# EAGLE design OBD-II (EAGLE 7.6.0)
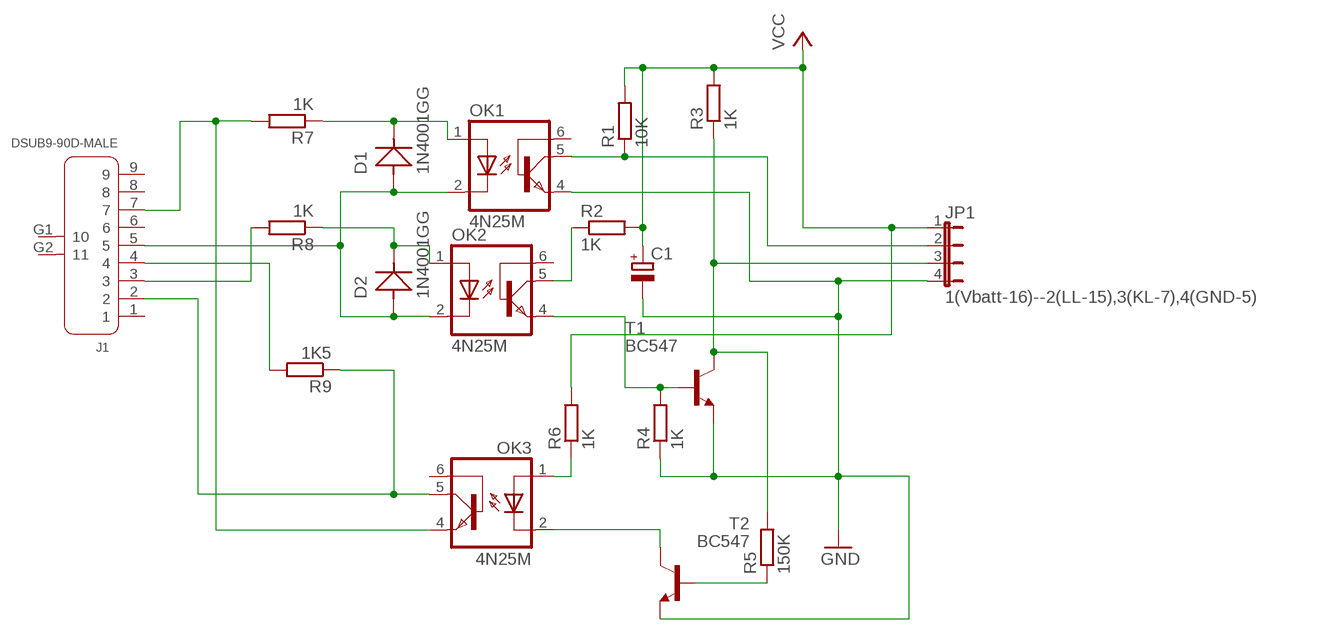
[diagram p0: schematic, sheet 1]

## Parts
C1  CPOL-EUE2-5  [E2-5]
D1  1N4001GG  [DO-41]
D2  1N4001GG  [DO-41]
J1  DSUB9-90D-MALE  DIP-MALE-DB9-CONNECTOR  [DSUB9+2P-2.77-90D-MALE]
JP1  1(Vbatt-16)--2(LL-15),3(KL-7),4(GND-5)  JP4E  [JP4]
OK1  4N25M  [DIL06]
OK2  4N25M  [DIL06]
OK3  4N25M  [DIL06]
R1  10K  R-EU_0207/10  [0207/10]
R2  1K  R-EU_0207/10  [0207/10]
R3  1K  R-EU_0207/10  [0207/10]
R4  1K  R-EU_0207/10  [0207/10]
R5  150K  R-EU_0207/10  [0207/10]
R6  1K  R-EU_0207/10  [0207/10]
R7  1K  R-EU_0207/10  [0207/10]
R8  1K  R-EU_0207/10  [0207/10]
R9  1K5  R-EU_0207/10  [0207/10]
T1  BC547  [TO92]
T2  BC547  [TO92]

## Nets
GND: C1.- JP1.4 OK1.4(EMI) R4.1 T1.1(E) T2.1(E)
N$1: JP1.2 OK1.5(COL) R1.1
N$2: J1.2 OK3.5(COL) R9.1
N$3: J1.4 R9.2
N$4: J1.3 R8.2
N$5: OK2.5(COL) R2.1
N$6: JP1.3 R3.1 R5.2 T1.3(C)
N$7: OK2.4(EMI) R4.2 T1.2(B)
N$8: J1.7 OK3.4(EMI) R7.2
N$10: R5.1 T2.2(B)
N$11: OK3.1(A) R6.1
N$12: D1.A D2.A J1.5 OK1.2(C) OK2.2(C)
N$13: OK3.2(C) T2.3(C)
N$16: D2.C OK2.1(A) R8.1
N$17: D1.C OK1.1(A) R7.1
VCC: C1.+ JP1.1 R1.2 R2.2 R3.2 R6.2
Unconnected: J1.1 J1.6 J1.8 J1.9 J1.G1 J1.G2 OK1.6(BAS) OK2.6(BAS) OK3.6(BAS)

## Library data of the parts
C1 = rcl:CPOL-EU: POLARIZED CAPACITOR, European symbol
D1 D2 = Volks73-ONSemiconductor:1N*?: Diode Axial Lead Standard Recovery Rectifiers Documentation Datasheet <http://www.onsemi.com/pub_link/Collateral/1N4001-D.PDF> Features Shipped in Plastic Bags, 1000 per bag Available Tape and Reeled, 5000 per reel, by adding a “RL” suffix to the part number Available in Fan−Fold Packaging, 3000 per box, by adding a “FF” suffix to the part number Pb−Free Packages are Available Mechanical Characteristics Case: Epoxy, Molded Weight: 0.4 gram (approximately) Finish: All External Surfaces Corrosion Resistant and Terminal Leads are Readily Solderable Lead and Mounting Surface Temperature for Soldering Purposes: 260°C Max. for 10 Seconds, 1/16 in. from case Polarity: Cathode Indicated by Polarity Band; CAPACITANCE: -; CATEGORY: Discrete Semiconductor Products; CURRENT-AVERAGE_RECTIFIED: 1A; CURRENT-REVERSE_LEAKAGE: 10uA @ 50V; DESCRIPTION: DIODE GEN PURP 50V 1A DO41; DIODE_TYPE: Standard; DOCUMENTATION_LINK: <a href="http://www.onsemi.com/pub_link/Collateral/1N4001-D.PDF">Datasheet</a>; DOCUMENTATION_URL: http://www.onsemi.com/pub_link/Collateral/1N4001-D.PDF; FAMILY: Diodes, Rectifiers, - Single; MANUFACTURER: ON Semiconductor; MOUNTING_TYPE: Through Hole; OPERATING_TEMPERATURE-JUNCTION: -64C ~ 175C; PACKAGE: DO-204AL, DO-41, Axial; PART_NUMBER: 1N4001G; REVERSE_RECOVERY-TIME: -; SERIES: -; SPEED: Standard Recovery >500ns, > 200mA (Io); SUPPLIER_DEVICE_PACKAGE: DO-41; SUPPLIER_ITEM_LINK: <a href="http://www.digikey.com/product-detail/en/1N4001G/1N4001GOS-ND/1485468">Details</a>; SUPPLIER_ITEM_NUMBER: 1N4001GOS-ND; SUPPLIER_ITEM_URL: http://www.digikey.com/product-detail/en/1N4001G/1N4001GOS-ND/1485468; SUPPLIER_LINK: <a href="http://www.digikey.com">Home Page</a>; SUPPLIER_NAME: Digi-Key; SUPPLIER_URL: http://www.digikey.com; VOLTAGE-DC_REVERSE: 50V; VOLTAGE-FORWARD: 1.1V @ 1A
J1 = Seeed-OPL-Connector:DIP-MALE-DB9-CONNECTOR: 320110017
JP1 = jumper:JP4E: JUMPER
OK1-OK3 = optocoupler:4N*?M: General Purpose 6-Pin Phototransistor Optocouplers Source: http://www.fairchildsemi.com/ds/4N/4N35-M.pdf; MPN: 4N25-M; OC_FARNELL: 1021349; OC_NEWARK: 98K9084
R1-R9 = rcl:R-EU_: RESISTOR, European symbol
T1 T2 = transistor:BC547: NPN TRANSISTOR

## Board
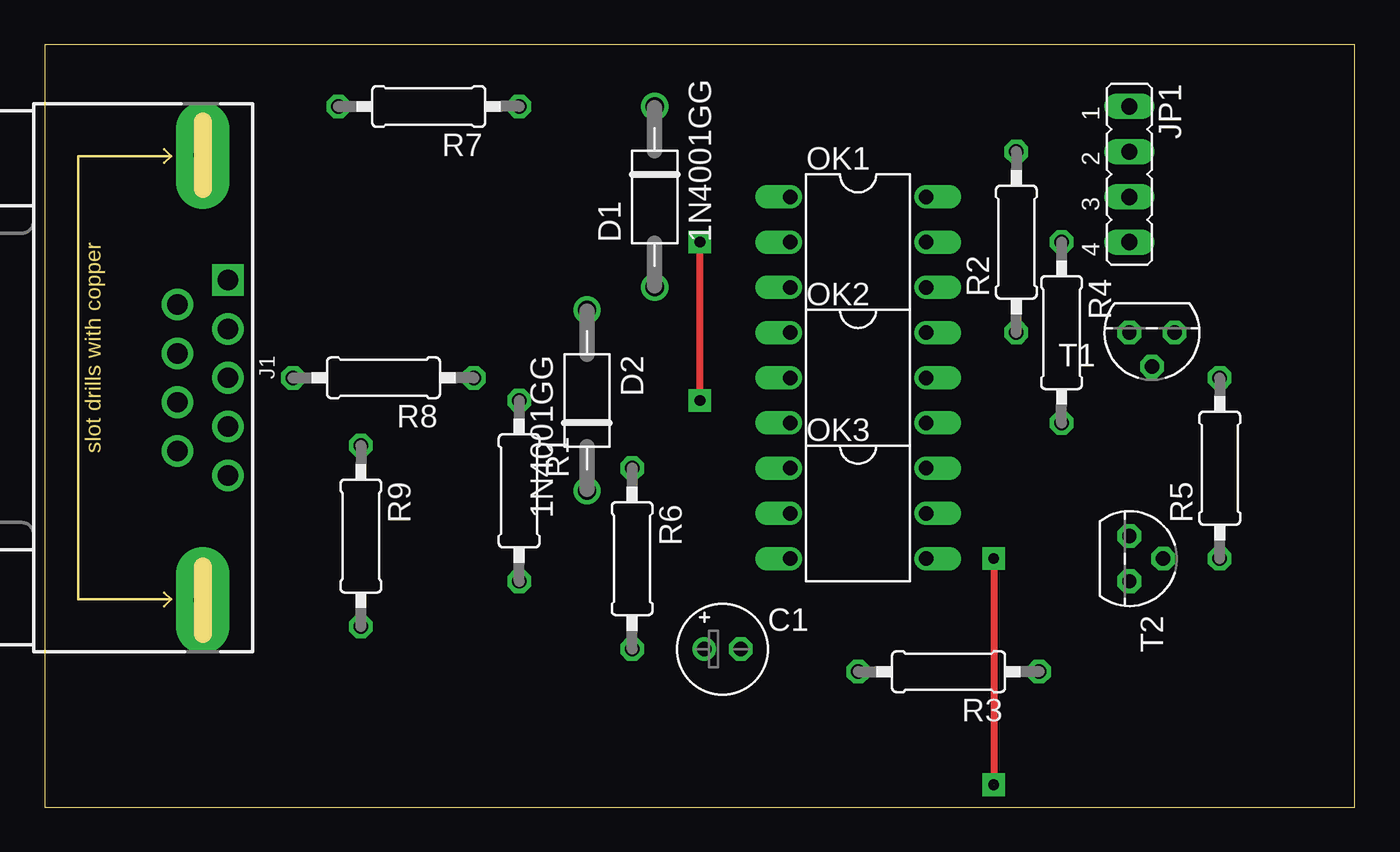
[diagram p1: board, top side]
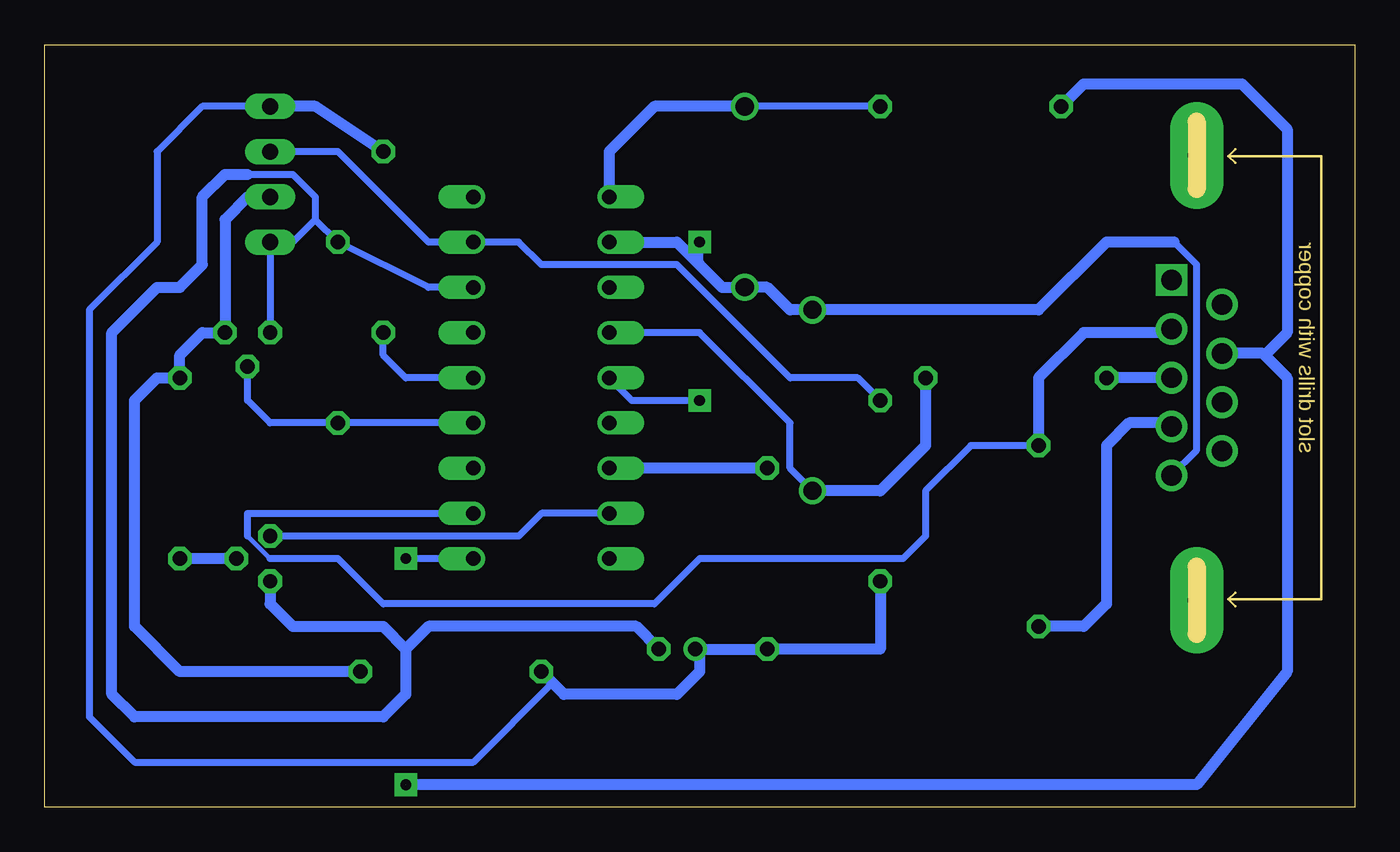
[diagram p2: board, bottom side, seen from below]

Size 73.64 x 42.85 mm. Coordinates in mm from the lower left corner, seen from the top.
Outline: 0,0 73.64,0 73.64,42.85 0,42.85 0,0
Copper layers (1*16): Top 0.035mm / dielectric 1.5mm / Bottom 0.035mm
Design rules "default": minimum track width 10mil, minimum drill 24mil, track to track 8mil, track to pad 8mil, pad to pad 8mil, via to via 8mil, smd to smd 8mil, copper to edge 40mil, drill to drill 8mil, minimum pad ring 10mil, minimum via ring 8mil, stop-mask expansion 4mil, vias tented up to drill 0mil, thermal gap 10mil

### Footprints (pad centres in the part's own frame; a part is rotated, then mirrored left to right if it is on the bottom)
E2-5 = drill 0.813 pad 1.27: + -1.016,0 | drill 0.813 pad 1.27 octagon: - 1.016,0
DO-41 = drill 1.016: A 0,-5.08; C 0,5.08
DSUB9+2P-2.77-90D-MALE = drill 1.143 pad 1.778 square: 1 -5.486,1.422 | drill 1.143 pad 1.778: 2 -2.743,1.422; 3 0,1.422; 4 2.743,1.422; 5 5.486,1.422; 6 -4.115,-1.422; 7 -1.372,-1.422; 8 1.372,-1.422; 9 4.115,-1.422 | drill 1 pad 3 long: G1 12.497,0; G2 -12.497,0
JP4 = drill 0.914 long: 1 -3.81,0; 2 -1.27,0; 3 1.27,0; 4 3.81,0
DIL06 = drill 0.813 offset: 1 -2.54,-3.81; 2 0,-3.81; 3 2.54,-3.81; 4 2.54,3.81; 5 0,3.81; 6 -2.54,3.81
0207/10 = drill 0.813 octagon: 1 -5.08,0; 2 5.08,0
TO92 = drill 0.813 octagon: 1 1.27,0; 2 0,1.905; 3 -1.27,0

### Placement (x,y rotation side)
C1  38.1,8.89 0 top
D1  34.29,34.29 0 top
D2  30.48,22.86 180 top
J1  8.89,24.13 270 top
JP1  60.96,35.56 270 top
OK1  45.72,31.75 270 top
OK2  45.72,24.13 270 top
OK3  45.72,16.51 270 top
R1  26.67,17.78 270 top
R2  54.61,31.75 90 top
R3  50.8,7.62 180 top
R4  57.15,26.67 270 top
R5  66.04,19.05 90 top
R6  33.02,13.97 270 top
R7  21.59,39.37 180 top
R8  19.05,24.13 180 top
R9  17.78,15.24 270 top
T1  62.23,26.67 180 top
T2  60.96,13.97 270 top

### Tracks (layer width: path | path; a pad name or v marks a point on that pad's centre or on a via)
GND
  Bottom 0.406: 62.23,35.56 59.69,35.56 58.42,34.29 58.42,33.02 | 58.42,33.02 59.69,31.75 JP1.4 T1.1 | 58.42,33.02 R4.1 52.07,29.21 OK1.4
  Bottom 0.61: T2.1 60.96,11.43 59.69,10.16 54.61,10.16 53.34,8.89 | 53.34,8.89 53.34,6.35 54.61,5.08 68.58,5.08 69.85,6.35 69.85,26.67 67.31,29.21 66.04,29.21 64.77,30.48 64.77,34.29 63.5,35.56 62.23,35.56 | C1.- 40.39,10.16 52.07,10.16 53.34,8.89
N$1
  Bottom 0.406: JP1.2 57.15,36.83 52.07,31.75 OK1.5 46.99,31.75 45.72,30.48 38.1,30.48 31.75,24.13 27.94,24.13 R1.1
N$2
  Bottom 0.254: 60.96,13.97 62.23,15.24
  Bottom 0.406: R9.1 21.59,20.32 24.13,17.78 24.13,15.24 25.4,13.97 36.83,13.97 39.37,11.43 54.61,11.43 57.15,13.97 60.96,13.97 | 62.23,15.24 62.23,16.51 OK3.5
  Bottom 0.61: J1.2 10.52,26.67 15.24,26.67 17.78,24.13 R9.1
N$3
  Bottom 0.61: J1.4 10.52,21.59 12.7,21.59 13.97,20.32 13.97,11.43 15.24,10.16 R9.2
N$4
  Bottom 0.61: J1.3 R8.2
N$5
  Bottom 0.406: OK2.5 53.34,24.13 54.61,25.4 R2.1
N$6
  Bottom 0.61: R3.1 66.04,7.62 68.58,10.16 68.58,22.86 67.31,24.13 R5.2 66.04,25.4 64.77,26.67 T1.3 63.5,33.02 62.23,34.29 JP1.3
N$7
  Bottom 0.406: OK2.4 R4.2 60.96,21.59 62.23,22.86 T1.2
N$8  (via drill 0.6 pad 1.27)  (1 unrouted)
  Top 0.406: v53.34,13.97 53.34,1.27
  Bottom 0.406: OK3.4 v53.34,13.97 | J1.7 5.08,25.4
  Bottom 0.61: R7.2 15.24,40.64 6.35,40.64 3.81,38.1 3.81,26.67 5.08,25.4 | 5.08,25.4 5.18,25.5 J1.7 | 5.08,25.4 3.81,24.13 3.81,7.62 8.89,1.27 53.34,1.27
N$9  (via drill 0.6 pad 1.27)
  other vias: 53.34,1.27
N$10
  Bottom 0.61: T2.2 R5.1
N$11
  Bottom 0.61: R6.1 OK3.1
N$12  (via drill 0.6 pad 1.27)
  Top 0.406: v36.83,22.86 v36.83,31.75
  Bottom 0.406: J1.5 8.89,20.07 8.89,30.48 10.16,31.75 | OK2.2 40.64,22.86 v36.83,22.86 | v36.83,31.75 36.83,30.48
  Bottom 0.61: OK1.2 38.1,31.75 36.83,30.48 35.56,29.21 D1.A 33.02,29.21 31.75,27.94 D2.A 17.78,27.94 13.97,31.75 10.16,31.75
N$13
  Bottom 0.406: OK3.2 45.72,16.51 46.99,15.24 T2.3
N$16
  Bottom 0.406: D2.C 31.75,19.05 31.75,21.59 36.83,26.67 OK2.1
  Bottom 0.61: R8.1 24.13,20.32 26.67,17.78 D2.C
N$17
  Bottom 0.406: R7.1 D1.C
  Bottom 0.61: D1.C 39.37,39.37 41.91,36.83 OK1.1
VCC
  Bottom 0.406: JP1.1 64.77,39.37 67.31,36.83 67.31,31.75 71.12,27.94 71.12,5.08 68.58,2.54 49.53,2.54 45.09,6.98
  Bottom 0.61: R2.2 58.42,39.37 JP1.1 | R1.2 26.67,8.89 R6.2 C1.+ 36.83,8.64 36.83,7.62 38.1,6.35 44.45,6.35 45.09,6.98 R3.2